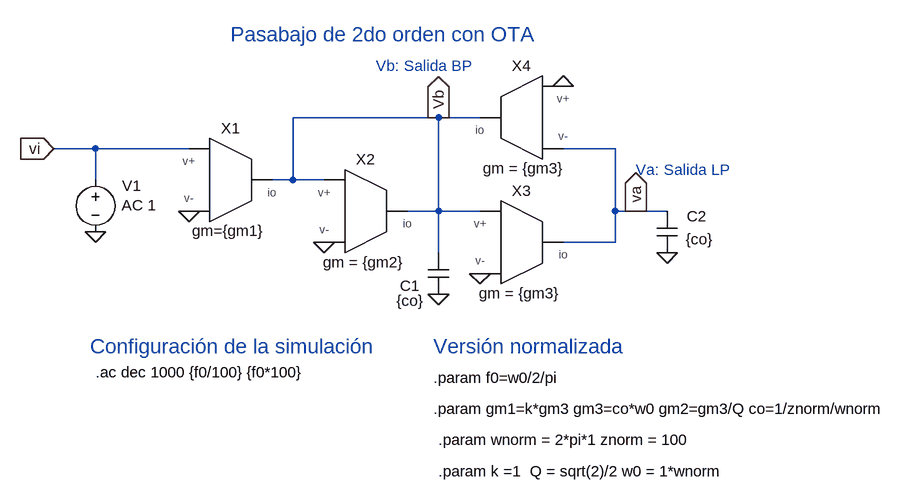
[diagram p0: schematic OTA pasabajo 2do orden.asc]
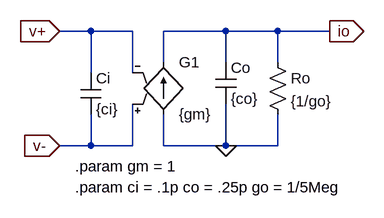
[diagram p1: sub-circuit ota.asc]
OTA pasabajo 2do orden.asc, the LTspice schematic file:
Version 4.1
SHEET 1 1188 880
WIRE 352 -16 128 -16
WIRE 416 -16 352 -16
WIRE -176 32 -240 32
WIRE -32 32 -176 32
WIRE 624 32 544 32
WIRE -176 80 -176 32
WIRE 128 80 128 -16
WIRE 128 80 96 80
WIRE 176 80 128 80
WIRE 352 128 352 -16
WIRE 352 128 304 128
WIRE 416 128 352 128
WIRE 624 128 624 32
WIRE 656 128 624 128
WIRE 704 128 656 128
WIRE 624 176 624 128
WIRE 624 176 544 176
WIRE 352 192 352 128
FLAG -176 160 0
FLAG -240 32 vi
IOPIN -240 32 In
FLAG 416 224 0
FLAG 544 -64 0
FLAG 704 192 0
FLAG 656 128 va
IOPIN 656 128 Out
FLAG -32 128 0
FLAG 176 176 0
FLAG 352 256 0
FLAG 352 -16 Vb
IOPIN 352 -16 Out
SYMBOL voltage -176 64 R0
WINDOW 123 40 55 Left 2
WINDOW 39 0 0 Left 0
WINDOW 0 41 25 Left 2
SYMATTR Value2 AC 1
SYMATTR InstName V1
SYMATTR Value ""
SYMBOL OTA 48 80 R0
WINDOW 39 -19 94 Bottom 2
SYMATTR SpiceLine gm={gm1}
SYMATTR InstName X1
SYMBOL OTA 256 128 R0
WINDOW 39 -19 94 Bottom 2
SYMATTR SpiceLine gm = {gm2}
SYMATTR InstName X2
SYMBOL cap 688 128 R0
WINDOW 0 46 8 Left 2
WINDOW 3 45 43 Left 2
SYMATTR InstName C2
SYMATTR Value {co}
SYMBOL OTA 496 176 R0
WINDOW 39 -19 94 Bottom 2
SYMATTR SpiceLine gm = {gm3}
SYMATTR InstName X3
SYMBOL OTA 464 -16 M0
WINDOW 39 -19 94 Bottom 2
SYMATTR SpiceLine gm = {gm3}
SYMATTR InstName X4
SYMBOL cap 336 192 R0
WINDOW 0 -43 51 Left 2
WINDOW 3 -49 74 Left 2
SYMATTR InstName C1
SYMATTR Value {co}
TEXT -176 376 Left 2 !.ac dec 1000 {f0/100} {f0*100}
TEXT 352 528 Left 2 !.param k =1  Q = sqrt(2)/2 w0 = 1*wnorm
TEXT -184 336 Left 3 ;Configuración de la simulación
TEXT 344 336 Left 3 ;Versión normalizada
TEXT 344 384 Left 2 !.param f0=w0/2/pi
TEXT 32 -144 Left 3 ;Pasabajo de 2do orden con OTA
TEXT 344 432 Left 2 !.param gm1=k*gm3 gm3=co*w0 gm2=gm3/Q co=1/znorm/wnorm
TEXT 352 480 Left 2 !.param wnorm = 2*pi*1 znorm = 100
TEXT 656 64 Left 2 ;Va: Salida LP
TEXT 256 -96 Left 2 ;Vb: Salida BP

ota.asc, the sub-circuit schematic file:
Version 4
SHEET 1 880 680
WIRE -16 80 -64 80
WIRE 48 80 -16 80
WIRE 192 80 96 80
WIRE 272 80 192 80
WIRE 352 80 272 80
WIRE 96 128 96 80
WIRE 192 128 192 80
WIRE 272 128 272 80
WIRE -16 144 -16 80
WIRE 48 144 48 80
WIRE -16 256 -16 208
WIRE -16 256 -64 256
WIRE 48 256 48 192
WIRE 48 256 -16 256
WIRE 96 256 96 208
WIRE 192 256 192 192
WIRE 192 256 96 256
WIRE 272 256 272 208
WIRE 272 256 192 256
FLAG 352 80 io
IOPIN 352 80 Out
FLAG -64 80 v+
IOPIN -64 80 In
FLAG -64 256 v-
IOPIN -64 256 In
FLAG 192 256 0
SYMBOL cap -32 144 R0
SYMATTR InstName Ci
SYMATTR Value {ci}
SYMATTR SpiceLine Rser=0
SYMBOL cap 176 128 R0
SYMATTR InstName Co
SYMATTR Value {co}
SYMATTR SpiceLine Rser=0
SYMBOL res 256 112 R0
SYMATTR InstName Ro
SYMATTR Value {1/go}
SYMBOL g2 96 112 R0
SYMATTR InstName G1
SYMATTR Value {gm}
TEXT -40 288 Left 2 !.param gm = 1
TEXT -40 320 Left 2 !.param ci = .1p co = .25p go = 1/5Meg

The netlist it stands for:
* OTA pasabajo 2do orden.asc
V1 vi 0 AC 1
X§X1 Vb vi 0 ota params: gm={gm1}
X§X2 Vb Vb 0 ota params: gm = {gm2}
C2 va 0 {co}
X§X3 va Vb 0 ota params: gm = {gm3}
X§X4 Vb 0 va ota params: gm = {gm3}
C1 Vb 0 {co}

* block symbol definitions
.subckt ota io v+ v-
Ci v+ v- {ci} Rser=0
Co io 0 {co} Rser=0
Ro io 0 {1/go}
G1 0 io v- v+ {gm}
.param gm = 1
.param ci = .1p co = .25p go = 1/5Meg
.ends ota

.ac dec 1000 {f0/100} {f0*100}
.param k =1  Q = sqrt(2)/2 w0 = 1*wnorm
* Configuración de la simulación
* Versión normalizada
.param f0=w0/2/pi
* Pasabajo de 2do orden con OTA
.param gm1=k*gm3 gm3=co*w0 gm2=gm3/Q co=1/znorm/wnorm
.param wnorm = 2*pi*1 znorm = 100
* Va: Salida LP
* Vb: Salida BP
.backanno
.end